# Altium schematic sheet 1_P1.schdoc
size 417 x 295 mm
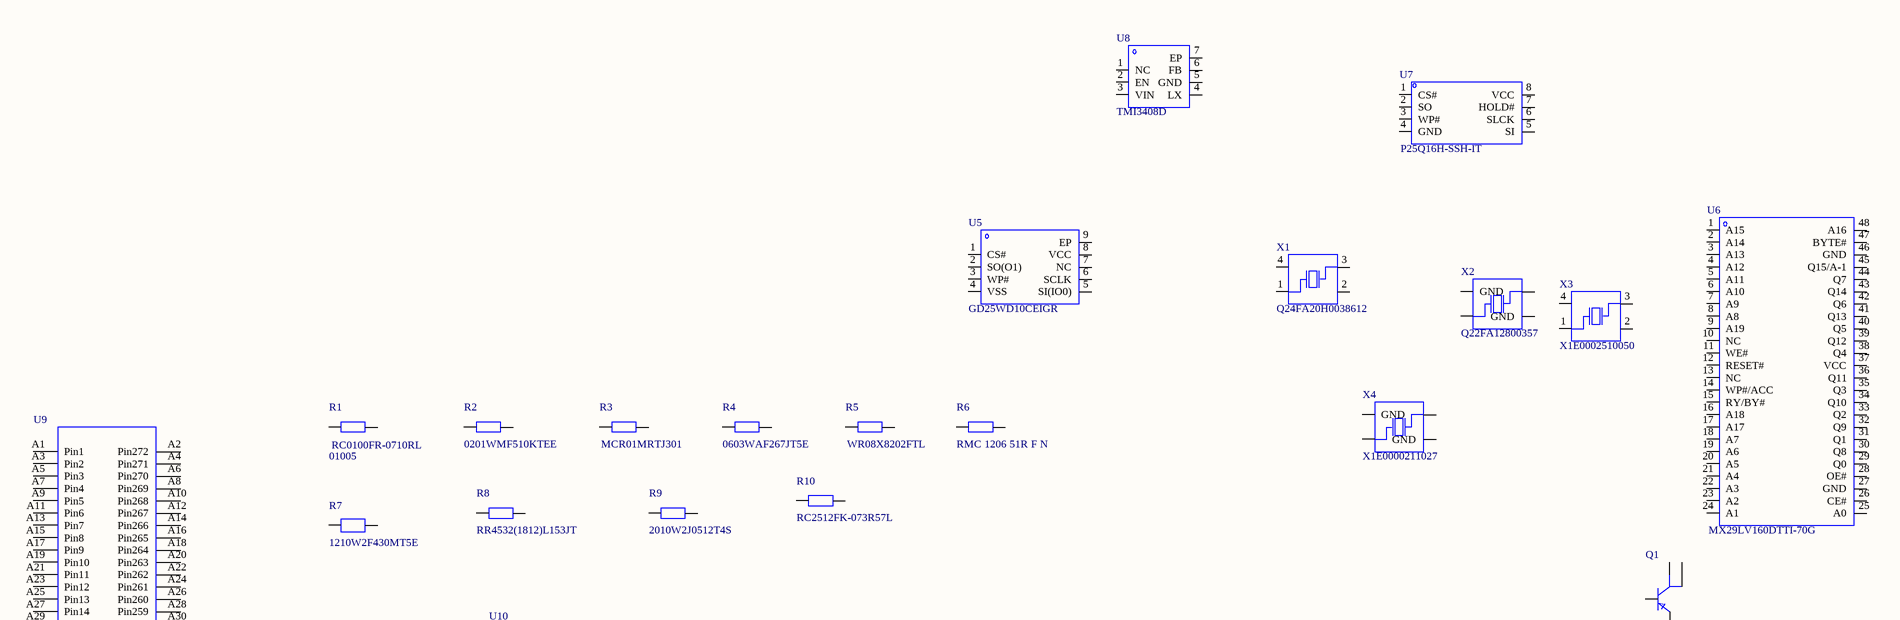
[diagram p0: 1_P1.schdoc, top]
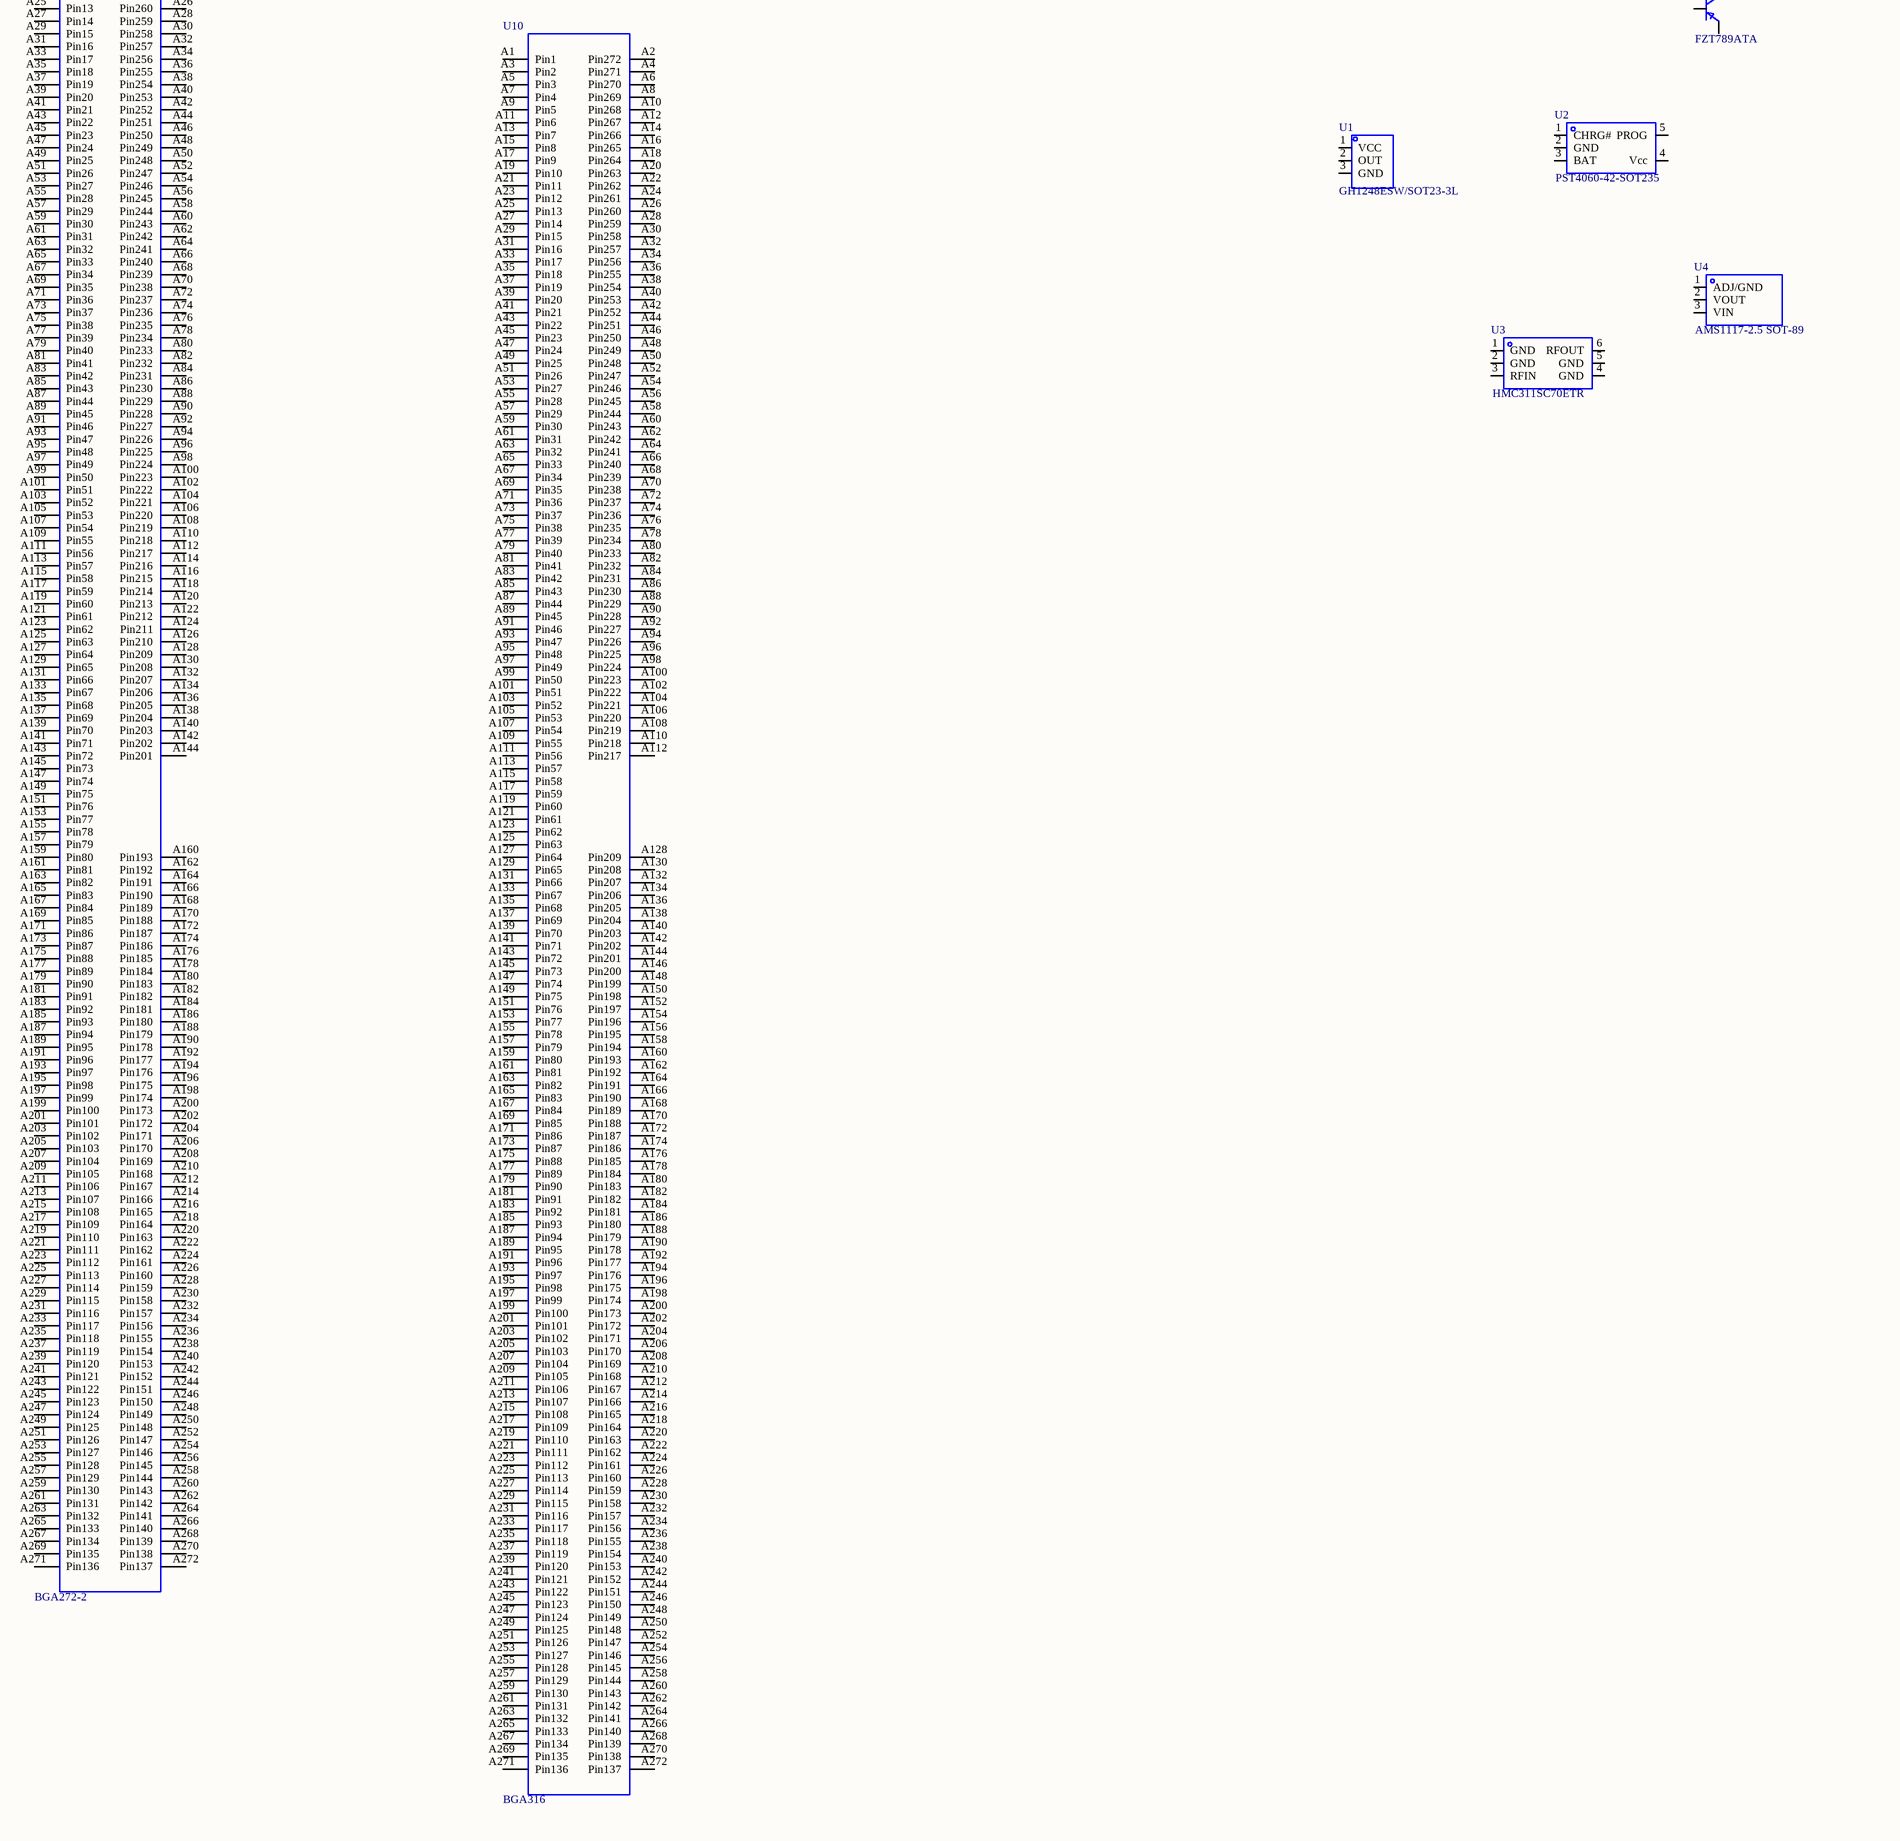
[diagram p1: 1_P1.schdoc, bottom]

## Parts
Q1  (no value)  [SOT-223-3_L6.5-W3.4-P2.30-LS7.0-BR]
R1  Supplier Footprint: 01005  [R01005]
R2  (no value)  [R0201]
R3  (no value)  [R0402]
R4  (no value)  [R0603]
R5  (no value)  [R0805]
R6  (no value)  [R1206]
R7  (no value)  [R1210]
R8  (no value)  [R1812]
R9  (no value)  [R2010]
R10  (no value)  [R2512]
U1  (no value)  [SOT-23-3_L2.9-W1.6-P1.90-LS2.8-BR]
U2  (no value)  [SOT-23-5_L3.0-W1.7-P0.95-LS2.8-BR]
U3  (no value)  [SC-70-6_L2.2-W1.3-P0.65-LS2.1-BR]
U4  (no value)  [SOT-89-3_L4.5-W2.5-P1.50-LS4.2-BR]
U5  (no value)  [USON8_L2.0-W3.0-P0.50-BL-EP]
U6  (no value)  [TSOP-48_L12.0-W18.4-P0.50-LS20.0-BL]
U7  (no value)  [SOIC-8_L4.9-W3.9-P1.27-LS6.0-BL]
U8  (no value)  [DFN-6_L2.0-W2.0-P0.65-BL-EP]
U9  (no value)  [BGA272_0R55]
U10  (no value)  [BGA316]
X1  (no value)  [OSC-SMD_4P-L2.5-W2.0-BL]
X2  (no value)  [OSC-SMD_4P-L2.0-W1.6-BL]
X3  (no value)  [OSC-SMD_4P-L1.6-W1.2-BL]
X4  (no value)  [OSC-SMD_4P-L3.2-W2.5-BL]

## Nets

Not connected (* = marked no-connect by the designer): Q1 1(B) 2(C) 3(E) 4(C); R1 1 2; R2 1 2; R3 1 2; R4 1 2; R5 1 2; R6 1 2; R7 1 2; R8 1 2; R9 1 2; R10 1 2; U1 1(VCC) 2(OUT) 3(GND); U2 1(CHRG#) 2(GND) 3(BAT) 4(Vcc) 5(PROG); U3 1(GND) 2(GND) 3(RFIN) 4(GND) 5(GND) 6(RFOUT); U4 1(ADJ/GND) 2(VOUT) 3(VIN); U5 1(CS#) 2(SO(O1)) 3(WP#) 4(VSS) 5(SI(IO0)) 6(SCLK) 7(NC) 8(VCC) 9(EP); U6 1(A15) 2(A14) 3(A13) 4(A12) 5(A11) 6(A10) 7(A9) 8(A8) 9(A19) 10(NC) 11(WE#) 12(RESET#) 13(NC) 14(WP#/ACC) 15(RY/BY#) 16(A18) 17(A17) 18(A7) 19(A6) 20(A5) 21(A4) 22(A3) 23(A2) 24(A1) 25(A0) 26(CE#) 27(GND) 28(OE#) 29(Q0) 30(Q8) 31(Q1) 32(Q9) 33(Q2) 34(Q10) 35(Q3) 36(Q11) 37(VCC) 38(Q4) 39(Q12) 40(Q5) 41(Q13) 42(Q6) 43(Q14) 44(Q7) 45(Q15/A-1) 46(GND) 47(BYTE#) 48(A16); U7 1(CS#) 2(SO) 3(WP#) 4(GND) 5(SI) 6(SLCK) 7(HOLD#) 8(VCC); U8 1(NC) 2(EN) 3(VIN) 4(LX) 5(GND) 6(FB) 7(EP); U9 A1(Pin1) A2(Pin272) A3(Pin2) A4(Pin271) A5(Pin3) A6(Pin270) A7(Pin4) A8(Pin269) A9(Pin5) A10(Pin268) A11(Pin6) A12(Pin267) A13(Pin7) A14(Pin266) A15(Pin8) A16(Pin265) A17(Pin9) A18(Pin264) A19(Pin10) A20(Pin263) A21(Pin11) A22(Pin262) A23(Pin12) A24(Pin261) A25(Pin13) A26(Pin260) A27(Pin14) A28(Pin259) A29(Pin15) A30(Pin258) A31(Pin16) A32(Pin257) A33(Pin17) A34(Pin256) A35(Pin18) A36(Pin255) A37(Pin19) A38(Pin254) A39(Pin20) A40(Pin253) A41(Pin21) A42(Pin252) A43(Pin22) A44(Pin251) A45(Pin23) A46(Pin250) A47(Pin24) A48(Pin249) A49(Pin25) A50(Pin248) A51(Pin26) A52(Pin247) A53(Pin27) A54(Pin246) A55(Pin28) A56(Pin245) A57(Pin29) A58(Pin244) A59(Pin30) A60(Pin243) A61(Pin31) A62(Pin242) A63(Pin32) A64(Pin241) A65(Pin33) A66(Pin240) A67(Pin34) A68(Pin239) A69(Pin35) A70(Pin238) A71(Pin36) A72(Pin237) A73(Pin37) A74(Pin236) A75(Pin38) A76(Pin235) A77(Pin39) A78(Pin234) A79(Pin40) A80(Pin233) A81(Pin41) A82(Pin232) A83(Pin42) A84(Pin231) A85(Pin43) A86(Pin230) A87(Pin44) A88(Pin229) A89(Pin45) A90(Pin228) A91(Pin46) A92(Pin227) A93(Pin47) A94(Pin226) A95(Pin48) A96(Pin225) A97(Pin49) A98(Pin224) A99(Pin50) A100(Pin223) A101(Pin51) A102(Pin222) A103(Pin52) A104(Pin221) A105(Pin53) A106(Pin220) A107(Pin54) A108(Pin219) A109(Pin55) A110(Pin218) A111(Pin56) A112(Pin217) A113(Pin57) A114(Pin216) A115(Pin58) A116(Pin215) A117(Pin59) A118(Pin214) A119(Pin60) A120(Pin213) A121(Pin61) A122(Pin212) A123(Pin62) A124(Pin211) A125(Pin63) A126(Pin210) A127(Pin64) A128(Pin209) A129(Pin65) A130(Pin208) A131(Pin66) A132(Pin207) A133(Pin67) A134(Pin206) A135(Pin68) A136(Pin205) A137(Pin69) A138(Pin204) A139(Pin70) A140(Pin203) A141(Pin71) A142(Pin202) A143(Pin72) A144(Pin201) A145(Pin73) A146(Pin200) A147(Pin74) A148(Pin199) A149(Pin75) A150(Pin198) A151(Pin76) A152(Pin197) A153(Pin77) A154(Pin196) A155(Pin78) A156(Pin195) A157(Pin79) A158(Pin194) A159(Pin80) A160(Pin193) A161(Pin81) A162(Pin192) A163(Pin82) A164(Pin191) A165(Pin83) A166(Pin190) A167(Pin84) A168(Pin189) A169(Pin85) A170(Pin188) A171(Pin86) A172(Pin187) A173(Pin87) A174(Pin186) A175(Pin88) A176(Pin185) A177(Pin89) A178(Pin184) A179(Pin90) A180(Pin183) A181(Pin91) A182(Pin182) A183(Pin92) A184(Pin181) A185(Pin93) A186(Pin180) A187(Pin94) A188(Pin179) A189(Pin95) A190(Pin178) A191(Pin96) A192(Pin177) A193(Pin97) A194(Pin176) A195(Pin98) A196(Pin175) A197(Pin99) A198(Pin174) A199(Pin100) A200(Pin173) A201(Pin101) A202(Pin172) A203(Pin102) A204(Pin171) A205(Pin103) A206(Pin170) A207(Pin104) A208(Pin169) A209(Pin105) A210(Pin168) A211(Pin106) A212(Pin167) A213(Pin107) A214(Pin166) A215(Pin108) A216(Pin165) A217(Pin109) A218(Pin164) A219(Pin110) A220(Pin163) A221(Pin111) A222(Pin162) A223(Pin112) A224(Pin161) A225(Pin113) A226(Pin160) A227(Pin114) A228(Pin159) A229(Pin115) A230(Pin158) A231(Pin116) A232(Pin157) A233(Pin117) A234(Pin156) A235(Pin118) A236(Pin155) A237(Pin119) A238(Pin154) A239(Pin120) A240(Pin153) A241(Pin121) A242(Pin152) A243(Pin122) A244(Pin151) A245(Pin123) A246(Pin150) A247(Pin124) A248(Pin149) A249(Pin125) A250(Pin148) A251(Pin126) A252(Pin147) A253(Pin127) A254(Pin146) A255(Pin128) A256(Pin145) A257(Pin129) A258(Pin144) A259(Pin130) A260(Pin143) A261(Pin131) A262(Pin142) A263(Pin132) A264(Pin141) A265(Pin133) A266(Pin140) A267(Pin134) A268(Pin139) A269(Pin135) A270(Pin138) A271(Pin136) A272(Pin137); U10 A1(Pin1) A2(Pin272) A3(Pin2) A4(Pin271) A5(Pin3) A6(Pin270) A7(Pin4) A8(Pin269) A9(Pin5) A10(Pin268) A11(Pin6) A12(Pin267) A13(Pin7) A14(Pin266) A15(Pin8) A16(Pin265) A17(Pin9) A18(Pin264) A19(Pin10) A20(Pin263) A21(Pin11) A22(Pin262) A23(Pin12) A24(Pin261) A25(Pin13) A26(Pin260) A27(Pin14) A28(Pin259) A29(Pin15) A30(Pin258) A31(Pin16) A32(Pin257) A33(Pin17) A34(Pin256) A35(Pin18) A36(Pin255) A37(Pin19) A38(Pin254) A39(Pin20) A40(Pin253) A41(Pin21) A42(Pin252) A43(Pin22) A44(Pin251) A45(Pin23) A46(Pin250) A47(Pin24) A48(Pin249) A49(Pin25) A50(Pin248) A51(Pin26) A52(Pin247) A53(Pin27) A54(Pin246) A55(Pin28) A56(Pin245) A57(Pin29) A58(Pin244) A59(Pin30) A60(Pin243) A61(Pin31) A62(Pin242) A63(Pin32) A64(Pin241) A65(Pin33) A66(Pin240) A67(Pin34) A68(Pin239) A69(Pin35) A70(Pin238) A71(Pin36) A72(Pin237) A73(Pin37) A74(Pin236) A75(Pin38) A76(Pin235) A77(Pin39) A78(Pin234) A79(Pin40) A80(Pin233) A81(Pin41) A82(Pin232) A83(Pin42) A84(Pin231) A85(Pin43) A86(Pin230) A87(Pin44) A88(Pin229) A89(Pin45) A90(Pin228) A91(Pin46) A92(Pin227) A93(Pin47) A94(Pin226) A95(Pin48) A96(Pin225) A97(Pin49) A98(Pin224) A99(Pin50) A100(Pin223) A101(Pin51) A102(Pin222) A103(Pin52) A104(Pin221) A105(Pin53) A106(Pin220) A107(Pin54) A108(Pin219) A109(Pin55) A110(Pin218) A111(Pin56) A112(Pin217) A113(Pin57) A114(Pin216) A115(Pin58) A116(Pin215) A117(Pin59) A118(Pin214) A119(Pin60) A120(Pin213) A121(Pin61) A122(Pin212) A123(Pin62) A124(Pin211) A125(Pin63) A126(Pin210) A127(Pin64) A128(Pin209) A129(Pin65) A130(Pin208) A131(Pin66) A132(Pin207) A133(Pin67) A134(Pin206) A135(Pin68) A136(Pin205) A137(Pin69) A138(Pin204) A139(Pin70) A140(Pin203) A141(Pin71) A142(Pin202) A143(Pin72) A144(Pin201) A145(Pin73) A146(Pin200) A147(Pin74) A148(Pin199) A149(Pin75) A150(Pin198) A151(Pin76) A152(Pin197) A153(Pin77) A154(Pin196) A155(Pin78) A156(Pin195) A157(Pin79) A158(Pin194) A159(Pin80) A160(Pin193) A161(Pin81) A162(Pin192) A163(Pin82) A164(Pin191) A165(Pin83) A166(Pin190) A167(Pin84) A168(Pin189) A169(Pin85) A170(Pin188) A171(Pin86) A172(Pin187) A173(Pin87) A174(Pin186) A175(Pin88) A176(Pin185) A177(Pin89) A178(Pin184) A179(Pin90) A180(Pin183) A181(Pin91) A182(Pin182) A183(Pin92) A184(Pin181) A185(Pin93) A186(Pin180) A187(Pin94) A188(Pin179) A189(Pin95) A190(Pin178) A191(Pin96) A192(Pin177) A193(Pin97) A194(Pin176) A195(Pin98) A196(Pin175) A197(Pin99) A198(Pin174) A199(Pin100) A200(Pin173) A201(Pin101) A202(Pin172) A203(Pin102) A204(Pin171) A205(Pin103) A206(Pin170) A207(Pin104) A208(Pin169) A209(Pin105) A210(Pin168) A211(Pin106) A212(Pin167) A213(Pin107) A214(Pin166) A215(Pin108) A216(Pin165) A217(Pin109) A218(Pin164) A219(Pin110) A220(Pin163) A221(Pin111) A222(Pin162) A223(Pin112) A224(Pin161) A225(Pin113) A226(Pin160) A227(Pin114) A228(Pin159) A229(Pin115) A230(Pin158) A231(Pin116) A232(Pin157) A233(Pin117) A234(Pin156) A235(Pin118) A236(Pin155) A237(Pin119) A238(Pin154) A239(Pin120) A240(Pin153) A241(Pin121) A242(Pin152) A243(Pin122) A244(Pin151) A245(Pin123) A246(Pin150) A247(Pin124) A248(Pin149) A249(Pin125) A250(Pin148) A251(Pin126) A252(Pin147) A253(Pin127) A254(Pin146) A255(Pin128) A256(Pin145) A257(Pin129) A258(Pin144) A259(Pin130) A260(Pin143) A261(Pin131) A262(Pin142) A263(Pin132) A264(Pin141) A265(Pin133) A266(Pin140) A267(Pin134) A268(Pin139) A269(Pin135) A270(Pin138) A271(Pin136) A272(Pin137); X1 1(OSC1) 2 3(OSC2) 4; X2 1(OSC1) 2(GND) 3(OSC2) 4(GND); X3 1(OSC1) 2 3(OSC2) 4; X4 1(OSC1) 2(GND) 3(OSC2) 4(GND)

## Library data of the parts
Q1 = FZT789ATA: Manufacturer: DIODES(美台); Add into BOM: yes; Transistor Type: PNP; Current - Collector (Ic) (Max): 3A; Voltage - Collector Emitter Breakdown (Max): 25V; Power - Max: 2W; Description: 晶体管类型:PNP;集电极电流Ic:3A;集射极击穿电压Vce:25V;额定功率:2W;; Symbol: FZT789ATA; Device: FZT789ATA; Supplier Part: C460089; Manufacturer Part: FZT789ATA; LCSC On Sale: 1; Supplier Footprint: SOT223; JLCPCB Part Class: Extended Part; JLCPCB On Sale: 1; Datasheet: https://atta.szlcsc.com/upload/public/pdf/source/20191129/C460089_84B98759FB4C7973BE7E022EA2317298.pdf; Supplier: LCSC; Convert to PCB: yes; JLCPCB Stock: 9
R1 = RC0100FR-0710RL: Manufacturer: YAGEO(国巨); Symbol: MCR004YZPJ472; Add into BOM: yes; Power(Watts): 1/32W; Tolerance: ±1.0%; Resistance: 10Ω; Overload Voltage (Max): 15V; Temperature Coefficient: ±300ppm/℃; Device: RC0100FR-0710RL; Supplier Part: C326978; Manufacturer Part: RC0100FR-0710RL; LCSC On Sale: 1; Price: 0.021612; JLCPCB Part Class: Extended Part; JLCPCB Stock: 0; Datasheet: https://atta.szlcsc.com/upload/public/pdf/source/20181031/C326978_CA70488E89CCD5A87116B3C432DC42D8.pdf; Supplier: LCSC; Convert to PCB: yes; Body Length: -; Operating Temperature Range: -55℃~+155℃; φD: -; Body Height: -; Body Width: -; Type: 厚膜电阻
R2 = 0201WMF510KTEE: Manufacturer: UNI-ROYAL(厚声); Add into BOM: yes; Tolerance: ±1%; Resistance: 5.1Ω; Power(Watts): 0.05W; Temperature Coefficient: -100ppm/℃~+350ppm/℃; Description: 精度:±1%;阻值:5.1Ω;功率:0.05W;温度系数:-100ppm/℃~+350ppm/℃;温度系数:-100ppm/℃~+350ppm/℃;; Symbol: 0201WMF510KTEE; Device: 0201WMF510KTEE; Supplier Part: C423496; Manufacturer Part: 0201WMF510KTEE; LCSC On Sale: 0; Supplier Footprint: 0201; Price: 0.007178; JLCPCB Part Class: Extended Part; JLCPCB Stock: 0; Datasheet: https://atta.szlcsc.com/upload/public/pdf/source/20191220/C423496_A7EFB4615CFAD9B345CF1CB35F7CA821.pdf; Supplier: LCSC; Convert to PCB: yes
R3 = MCR01MRTJ301: Manufacturer: ROHM(罗姆); Add into BOM: yes; Power(Watts): 0.063W; Tolerance: ±5%; Temperature Coefficient: ±200ppm/℃; Resistance: 300Ω; Description: 功率:0.063W;精度:±5%;温度系数:±200ppm/℃;温度系数:±200ppm/℃;阻值:300Ω;; Symbol: MCR01MRTJ301; Device: MCR01MRTJ301; Supplier Part: C308017; Manufacturer Part: MCR01MRTJ301; LCSC On Sale: 0; Supplier Footprint: 0402; Price: 0.021938; JLCPCB Part Class: Extended Part; JLCPCB Stock: 0; Datasheet: https://atta.szlcsc.com/upload/public/pdf/source/20180925/C308017_79E24152F18297E593BBD34EE36E5CA1.pdf; Supplier: LCSC; Convert to PCB: yes
R4 = 0603WAF267JT5E: Manufacturer: UNI-ROYAL(厚声); Add into BOM: yes; Resistance: 26.7Ω; Tolerance: ±1%; Temperature Coefficient: ±200ppm/℃; Power(Watts): 0.1W; Description: 阻值:26.7Ω;精度:±1%;温度系数:±200ppm/℃;温度系数:±200ppm/℃;功率:0.1W;; Symbol: 0603WAF267JT5E; Device: 0603WAF267JT5E; Supplier Part: C23010; Manufacturer Part: 0603WAF267JT5E; LCSC On Sale: 0; Supplier Footprint: 0603; Price: 0.006524; JLCPCB Part Class: Extended Part; JLCPCB Stock: 4865; JLCPCB On Sale: 1; Datasheet: https://atta.szlcsc.com/upload/public/pdf/source/20170920/C23010_1505901030926982397.pdf; Supplier: LCSC; Convert to PCB: yes
R5 = WR08X8202FTL: Manufacturer: 华新科(Walsin); Add into BOM: yes; Tolerance: ±1%; Resistance: 82kΩ; Temperature Coefficient: ±100ppm/℃; Power(Watts): 0.125W; Description: 精度:±1%;阻值:82kΩ;温度系数:±100ppm/℃;温度系数:±100ppm/℃;功率:0.125W;; Symbol: WR08X8202FTL; Device: WR08X8202FTL; Supplier Part: C168476; Manufacturer Part: WR08X8202FTL; LCSC On Sale: 1; Supplier Footprint: 0805; Price: 0.013367; JLCPCB Part Class: Extended Part; JLCPCB Stock: 23850; JLCPCB On Sale: 1; Datasheet: https://atta.szlcsc.com/upload/public/pdf/source/20180228/C168476_15198081785881378204.pdf; Supplier: LCSC; Convert to PCB: yes
R6 = RMC 1206 51R F N: Manufacturer: Tyohm(幸亚电阻); Symbol: RMC1206511%N; Add into BOM: yes; Power(Watts): 0.25W; Tolerance: ±1%; Resistance: 51Ω; Description: 功率:0.25W;精度:±1%;阻值:51Ω;; Device: RMC 1206 51R F N; Supplier Part: C269593; Manufacturer Part: RMC 1206 51R F N; LCSC On Sale: 1; Supplier Footprint: 1206; Price: 0.042969; JLCPCB Part Class: Extended Part; JLCPCB Stock: 0; JLCPCB On Sale: 1; Datasheet: https://atta.szlcsc.com/upload/public/pdf/source/20190115/C269593_4AFF6F20A19DB4A59F5CA6E2239642C5.pdf; Supplier: LCSC; Convert to PCB: yes
R7 = 1210W2F430MT5E: Manufacturer: UNI-ROYAL(厚声); Add into BOM: yes; Resistance: 0.043Ω; Tolerance: ±1%; Temperature Coefficient: ±800ppm/℃; Power(Watts): 0.5W; Description: 阻值:0.043Ω;精度:±1%;温度系数:±800ppm/℃;温度系数:±800ppm/℃;功率:0.5W;; Symbol: 1210W2F430MT5E; Device: 1210W2F430MT5E; Supplier Part: C407181; Manufacturer Part: 1210W2F430MT5E; LCSC On Sale: 0; Supplier Footprint: 1210; Price: 0.121913; JLCPCB Part Class: Extended Part; JLCPCB Stock: 0; Datasheet: https://atta.szlcsc.com/upload/public/pdf/source/20190725/C407181_01A85CB9D9A34761A9DC11A7932D1DB9.pdf; Supplier: LCSC; Convert to PCB: yes
R8 = RR4532(1812)L153JT: Manufacturer: SUP(美隆); Add into BOM: yes; Tolerance: ±5%; Resistance: 15kΩ; Description: 精度:±5%;阻值:15kΩ;; Symbol: RR4532(1812)L153JT; Device: RR4532(1812)L153JT; Supplier Part: C11180; Manufacturer Part: RR4532(1812)L153JT; LCSC On Sale: 0; Supplier Footprint: 1812; JLCPCB Part Class: Extended Part; JLCPCB On Sale: 0; Datasheet: https://atta.szlcsc.com/upload/public/pdf/source/20180228/C11180_15198052368931377081.pdf; Supplier: LCSC; Convert to PCB: yes; JLCPCB Stock: 0
R9 = 2010W2J0512T4S: Manufacturer: UNI-ROYAL(厚声); Add into BOM: yes; Tolerance: ±5%; Power(Watts): 0.5W; Temperature Coefficient: ±100ppm/℃; Resistance: 5.1kΩ; Description: 精度:±5%;功率:0.5W;温度系数:±100ppm/℃;温度系数:±100ppm/℃;阻值:5.1kΩ;; Symbol: 2010W2J0512T4S; Device: 2010W2J0512T4S; Supplier Part: C20440; Manufacturer Part: 2010W2J0512T4S; LCSC On Sale: 0; Supplier Footprint: 2010; Price: 0.091109; JLCPCB Part Class: Extended Part; JLCPCB Stock: 2965; JLCPCB On Sale: 1; Datasheet: https://atta.szlcsc.com/upload/public/pdf/source/20170920/C20440_1505887424296980501.pdf; Supplier: LCSC; Convert to PCB: yes
R10 = RC2512FK-073R57L: Manufacturer: YAGEO(国巨); Add into BOM: yes; Resistance: 3.57Ω; Tolerance: ±1.0%; Temperature Coefficient: ±200ppm/℃; Overload Voltage (Max): 200V; Power(Watts): 1W; Description: 阻值:3.57Ω;电阻长:-;精度:±1.0%;工作温度范围:-55℃~+155℃;工作温度范围:-55℃~+155℃;电阻直径:-;温度系数:±200ppm/℃;温度系数:±200ppm/℃;电阻高:-;电阻宽:-;类型:厚膜电阻;最大工作电压:200V;功率:1W;; Symbol: RC2512FK-073R57L; Device: RC2512FK-073R57L; Supplier Part: C326562; Manufacturer Part: RC2512FK-073R57L; LCSC On Sale: 1; Supplier Footprint: 2512; Price: 0.228059; JLCPCB Part Class: Extended Part; JLCPCB Stock: 0; Datasheet: https://atta.szlcsc.com/upload/public/pdf/source/20181031/C326562_DC7A54B93FA407F6F4FCB28A1F1518E8.pdf; Supplier: LCSC; Convert to PCB: yes; Body Length: -; Operating Temperature Range: -55℃~+155℃; φD: -; Body Height: -; Body Width: -; Type: 厚膜电阻
U1 = GH1248ESW/SOT23-3L: Manufacturer: 鑫雁; Symbol: GH1248; Add into BOM: yes; Description: 微功耗霍尔开关，常用于升级干簧管; Device: GH1248ESW/SOT23-3L; Supplier Part: C141653; Manufacturer Part: GH1248ESW/SOT23-3L; LCSC On Sale: 1; Supplier Footprint: SOT-23-3L; JLCPCB Part Class: Extended Part; Datasheet: https://atta.szlcsc.com/upload/public/pdf/source/20171123/C141653_15114109573941137611.pdf; Supplier: LCSC; Convert to PCB: yes; JLCPCB Stock: 0
U2 = PST4060-42-SOT235: Manufacturer: phaetonsemi(悦腾); Add into BOM: yes; Symbol: PST4060-42-SOT235; Device: PST4060-42-SOT235; Supplier Part: C516072; Manufacturer Part: PST4060-42-SOT235; LCSC On Sale: 1; Supplier Footprint: SOT-23-5; JLCPCB Part Class: Extended Part; JLCPCB On Sale: 1; Datasheet: https://atta.szlcsc.com/upload/public/pdf/source/20200421/C516072_A49B43575EF9960A7130330C8C63FFF9.pdf; Supplier: LCSC; Convert to PCB: yes; JLCPCB Stock: 2670
U3 = HMC311SC70ETR: Manufacturer: ADI(亚德诺)/LINEAR; Add into BOM: yes; Symbol: HMC311SC70ETR; Device: HMC311SC70ETR; Supplier Part: C661763; Manufacturer Part: HMC311SC70ETR; LCSC On Sale: 1; Supplier Footprint: SC-70-6; JLCPCB Part Class: Extended Part; JLCPCB On Sale: 1; Datasheet: https://atta.szlcsc.com/upload/public/pdf/source/20200703/C661763_CF50706C92B0C97C305B649745C6865A.pdf; Supplier: LCSC; Convert to PCB: yes; JLCPCB Stock: 0
U4 = AMS1117-2.5 SOT-89: Manufacturer: Slkor(萨科微); Add into BOM: yes; Symbol: AMS1117-2.5 SOT-89; Device: AMS1117-2.5 SOT-89; Supplier Part: C2690336; Manufacturer Part: AMS1117-2.5 SOT-89; LCSC On Sale: 1; Supplier Footprint: SOT-89; JLCPCB Part Class: Extended Part; JLCPCB On Sale: 1; Datasheet: https://atta.szlcsc.com/upload/public/pdf/source/20201231/C426566_7F22DB93439D00F3FA27143E4F28C6AA.pdf; Supplier: LCSC; Convert to PCB: yes; JLCPCB Stock: 0
U5 = GD25WD10CEIGR: Manufacturer: GigaDevice(兆易创新); Add into BOM: yes; Clock Frequency: 100MHz; Memory Format: FLASH; Memory Interface: SPI; Memory Size: 1Mb; Voltage - Supply: 1.65V ~ 3.6V; Page Programming Time - tPP: 1.6ms; Byte-Program Time - tBP: 40us/5us; Memory Type: Non-Volatile; Description: 技术:NOR Flash;时钟频率:100MHz;存储器构架(格式):FLASH;存储器接口类型:SPI;存储器容量:1Mb;存储器类型:Non-Volatile;; Symbol: GD25WD10CEIGR; Device: GD25WD10CEIGR; Supplier Part: C395503; Manufacturer Part: GD25WD10CEIGR; LCSC On Sale: 1; Supplier Footprint: USON-8_3x2mm; JLCPCB Part Class: Extended Part; JLCPCB On Sale: 1; Datasheet: https://atta.szlcsc.com/upload/public/pdf/source/20190530/C395503_7245048A5289A58621F68BF0E97843E8.pdf; Supplier: LCSC; Convert to PCB: yes; Technology: NOR Flash; Operating Temperature: -40℃~85℃; JLCPCB Stock: 0
U6 = MX29LV160DTTI-70G: Manufacturer: MXIC(旺宏电子); Add into BOM: yes; Memory Format: FLASH; Memory Interface: CFI; Memory Size: 16Mb (2M x 8); Voltage - Supply: 2.7V ~ 3.6V; Page Programming Time - tPP: 70ns; Memory Type: Non-Volatile; Description: 技术:NOR Flash;时钟频率:-;存储器构架(格式):FLASH;存储器接口类型:CFI;存储器容量:16Mb (2M x 8);存储器类型:Non-Volatile;; Symbol: MX29LV160DTTI-70G; Device: MX29LV160DTTI-70G; Supplier Part: C382736; Manufacturer Part: MX29LV160DTTI-70G; LCSC On Sale: 1; Supplier Footprint: TSOP; JLCPCB Part Class: Extended Part; JLCPCB On Sale: 1; Datasheet: https://atta.szlcsc.com/upload/public/pdf/source/20190327/C382736_2D0DBB6B55316A1755B53036C7990EFF.pdf; Supplier: LCSC; Convert to PCB: yes; Technology: NOR Flash; Clock Frequency: -; Operating Temperature: -40℃~85℃; Byte-Program Time - tBP: -; JLCPCB Stock: 0
U7 = P25Q16H-SSH-IT: Manufacturer: 普冉(PUYA); Add into BOM: yes; Memory Format: FLASH; Memory Interface: SPI - Dual/Quad I/O; Memory Size: 16Mb (16M x 1, 8M x 2, 4M x 4); Voltage - Supply: 2.3V ~ 3.6V; Memory Type: Non-Volatile; Description: 存储器构架(格式):FLASH;存储器接口类型:SPI - Dual/Quad I/O;存储器容量:16Mb (16M x 1, 8M x 2, 4M x 4);存储器类型:Non-Volatile;; Symbol: P25Q16H-SSH-IT; Device: P25Q16H-SSH-IT; Supplier Part: C194871; Manufacturer Part: P25Q16H-SSH-IT; LCSC On Sale: 1; Supplier Footprint: SOIC-8_150mil; JLCPCB Part Class: Extended Part; JLCPCB On Sale: 1; Datasheet: https://atta.szlcsc.com/upload/public/pdf/source/20180614/C194871_6D13A583535BC204E2A50FC3019DEF18.pdf; Supplier: LCSC; Convert to PCB: yes; JLCPCB Stock: 83
U8 = TMI3408D: Manufacturer: TMI(拓尔微); Add into BOM: yes; Description: 电源管理IC,DCDC,Buck,1.5MHz,2.5~6V,1.2A,DFN6(2*2),VFB=0.6V,TMI3408D(TMI); Symbol: TMI3408D; Device: TMI3408D; Supplier Part: C478957; Manufacturer Part: TMI3408D; LCSC On Sale: 1; Supplier Footprint: DFN; JLCPCB Part Class: Extended Part; JLCPCB On Sale: 1; Datasheet: https://atta.szlcsc.com/upload/public/pdf/source/20200106/C478957_14C4BC3B60CA9682B3E3B4B12C62C494.pdf; Supplier: LCSC; Convert to PCB: yes; JLCPCB Stock: 0
U9 = BGA272-2: Symbol: BGA272; Convert to PCB: yes; Device: BGA272-2; Add into BOM: yes
U10 = BGA316: Symbol: BGA272; Convert to PCB: yes; Device: BGA316; Add into BOM: yes
X1 = Q24FA20H0038612: Manufacturer: EPSON(爱普生); Add into BOM: yes; ESR (Equivalent Series Resistance): 150Ω; Crystal Type: 无源贴片晶振; Frequency: 12MHz; Frequency Tolerance: ±20ppm; Load Capacitance: 10pF; Description: 等效串联电阻（ESR）:150Ω;主频:12MHz;频率公差:±20ppm;负载电容值:10pF;; Symbol: Q24FA20H0038612; Device: Q24FA20H0038612; Supplier Part: C255944; Manufacturer Part: Q24FA20H0038612; LCSC On Sale: 0; Supplier Footprint: SMD-2520_4P; JLCPCB Part Class: Extended Part; JLCPCB On Sale: 0; Datasheet: https://atta.szlcsc.com/upload/public/pdf/source/20180822/C255944_A9CBEBCBE69A3D835D4A8EC5391F47B0.pdf; Supplier: LCSC; Convert to PCB: yes; Operating Temperature: -40℃~85℃; JLCPCB Stock: 0
X2 = Q22FA12800357: Manufacturer: EPSON(爱普生); Add into BOM: yes; ESR (Equivalent Series Resistance): 80Ω; Crystal Type: 无源贴片晶振; Frequency: 24.576MHz; Frequency Tolerance: ±50ppm; Load Capacitance: 12pF; Description: 等效串联电阻（ESR）:80Ω;主频:24.576MHz;频率公差:±50ppm;负载电容值:12pF;; Symbol: Q22FA12800357; Device: Q22FA12800357; Supplier Part: C255881; Manufacturer Part: Q22FA12800357; LCSC On Sale: 1; Supplier Footprint: SMD-2016_4P; JLCPCB Part Class: Extended Part; JLCPCB On Sale: 1; Datasheet: https://atta.szlcsc.com/upload/public/pdf/source/20180822/C255881_5514012F25D8FCFF8BCBCAA1A8860D4E.pdf; Supplier: LCSC; Convert to PCB: yes; Operating Temperature: -40℃~85℃; JLCPCB Stock: 1429
X3 = X1E0002510050: Manufacturer: EPSON(爱普生); Add into BOM: yes; ESR (Equivalent Series Resistance): 100Ω; Crystal Type: 无源贴片晶振; Frequency: 32MHz; Frequency Tolerance: ±10ppm; Load Capacitance: 9pF; Description: 等效串联电阻（ESR）:100Ω;主频:32MHz;频率公差:±10ppm;负载电容值:9pF;; Symbol: X1E0002510050; Device: X1E0002510050; Supplier Part: C255987; Manufacturer Part: X1E0002510050; LCSC On Sale: 1; Supplier Footprint: SMD-1612_4P; JLCPCB Part Class: Extended Part; JLCPCB On Sale: 1; Datasheet: https://atta.szlcsc.com/upload/public/pdf/source/20180822/C255987_2A3CDAE90D280C8527B590B80563CB3A.pdf; Supplier: LCSC; Convert to PCB: yes; Operating Temperature: -40℃~85℃; JLCPCB Stock: 1291
X4 = X1E0000211027: Manufacturer: EPSON(爱普生); Add into BOM: yes; ESR (Equivalent Series Resistance): 60Ω; Crystal Type: 无源贴片晶振; Frequency: 18.432MHz; Frequency Tolerance: ±10ppm; Load Capacitance: 12pF; Description: 等效串联电阻（ESR）:60Ω;主频:18.432MHz;频率公差:±10ppm;负载电容值:12pF;; Symbol: X1E0000211027; Device: X1E0000211027; Supplier Part: C255912; Manufacturer Part: X1E0000211027; LCSC On Sale: 1; Supplier Footprint: TSX-3225; JLCPCB Part Class: Extended Part; JLCPCB On Sale: 1; Datasheet: https://atta.szlcsc.com/upload/public/pdf/source/20180822/C255912_9DF1DEE090A291681DB73602197B7111.pdf; Supplier: LCSC; Convert to PCB: yes; Operating Temperature: -40℃~85℃; JLCPCB Stock: 374